# Altium schematic sheet DCDC_Jetson.SchDoc
size 420 x 297 mm; Address1: Address1; Address2: Address2; Address3: Address3; Address4: Address4; DocumentNumber: 6; SheetNumber: 6; SheetTotal: 6; Перв_применение: Э3
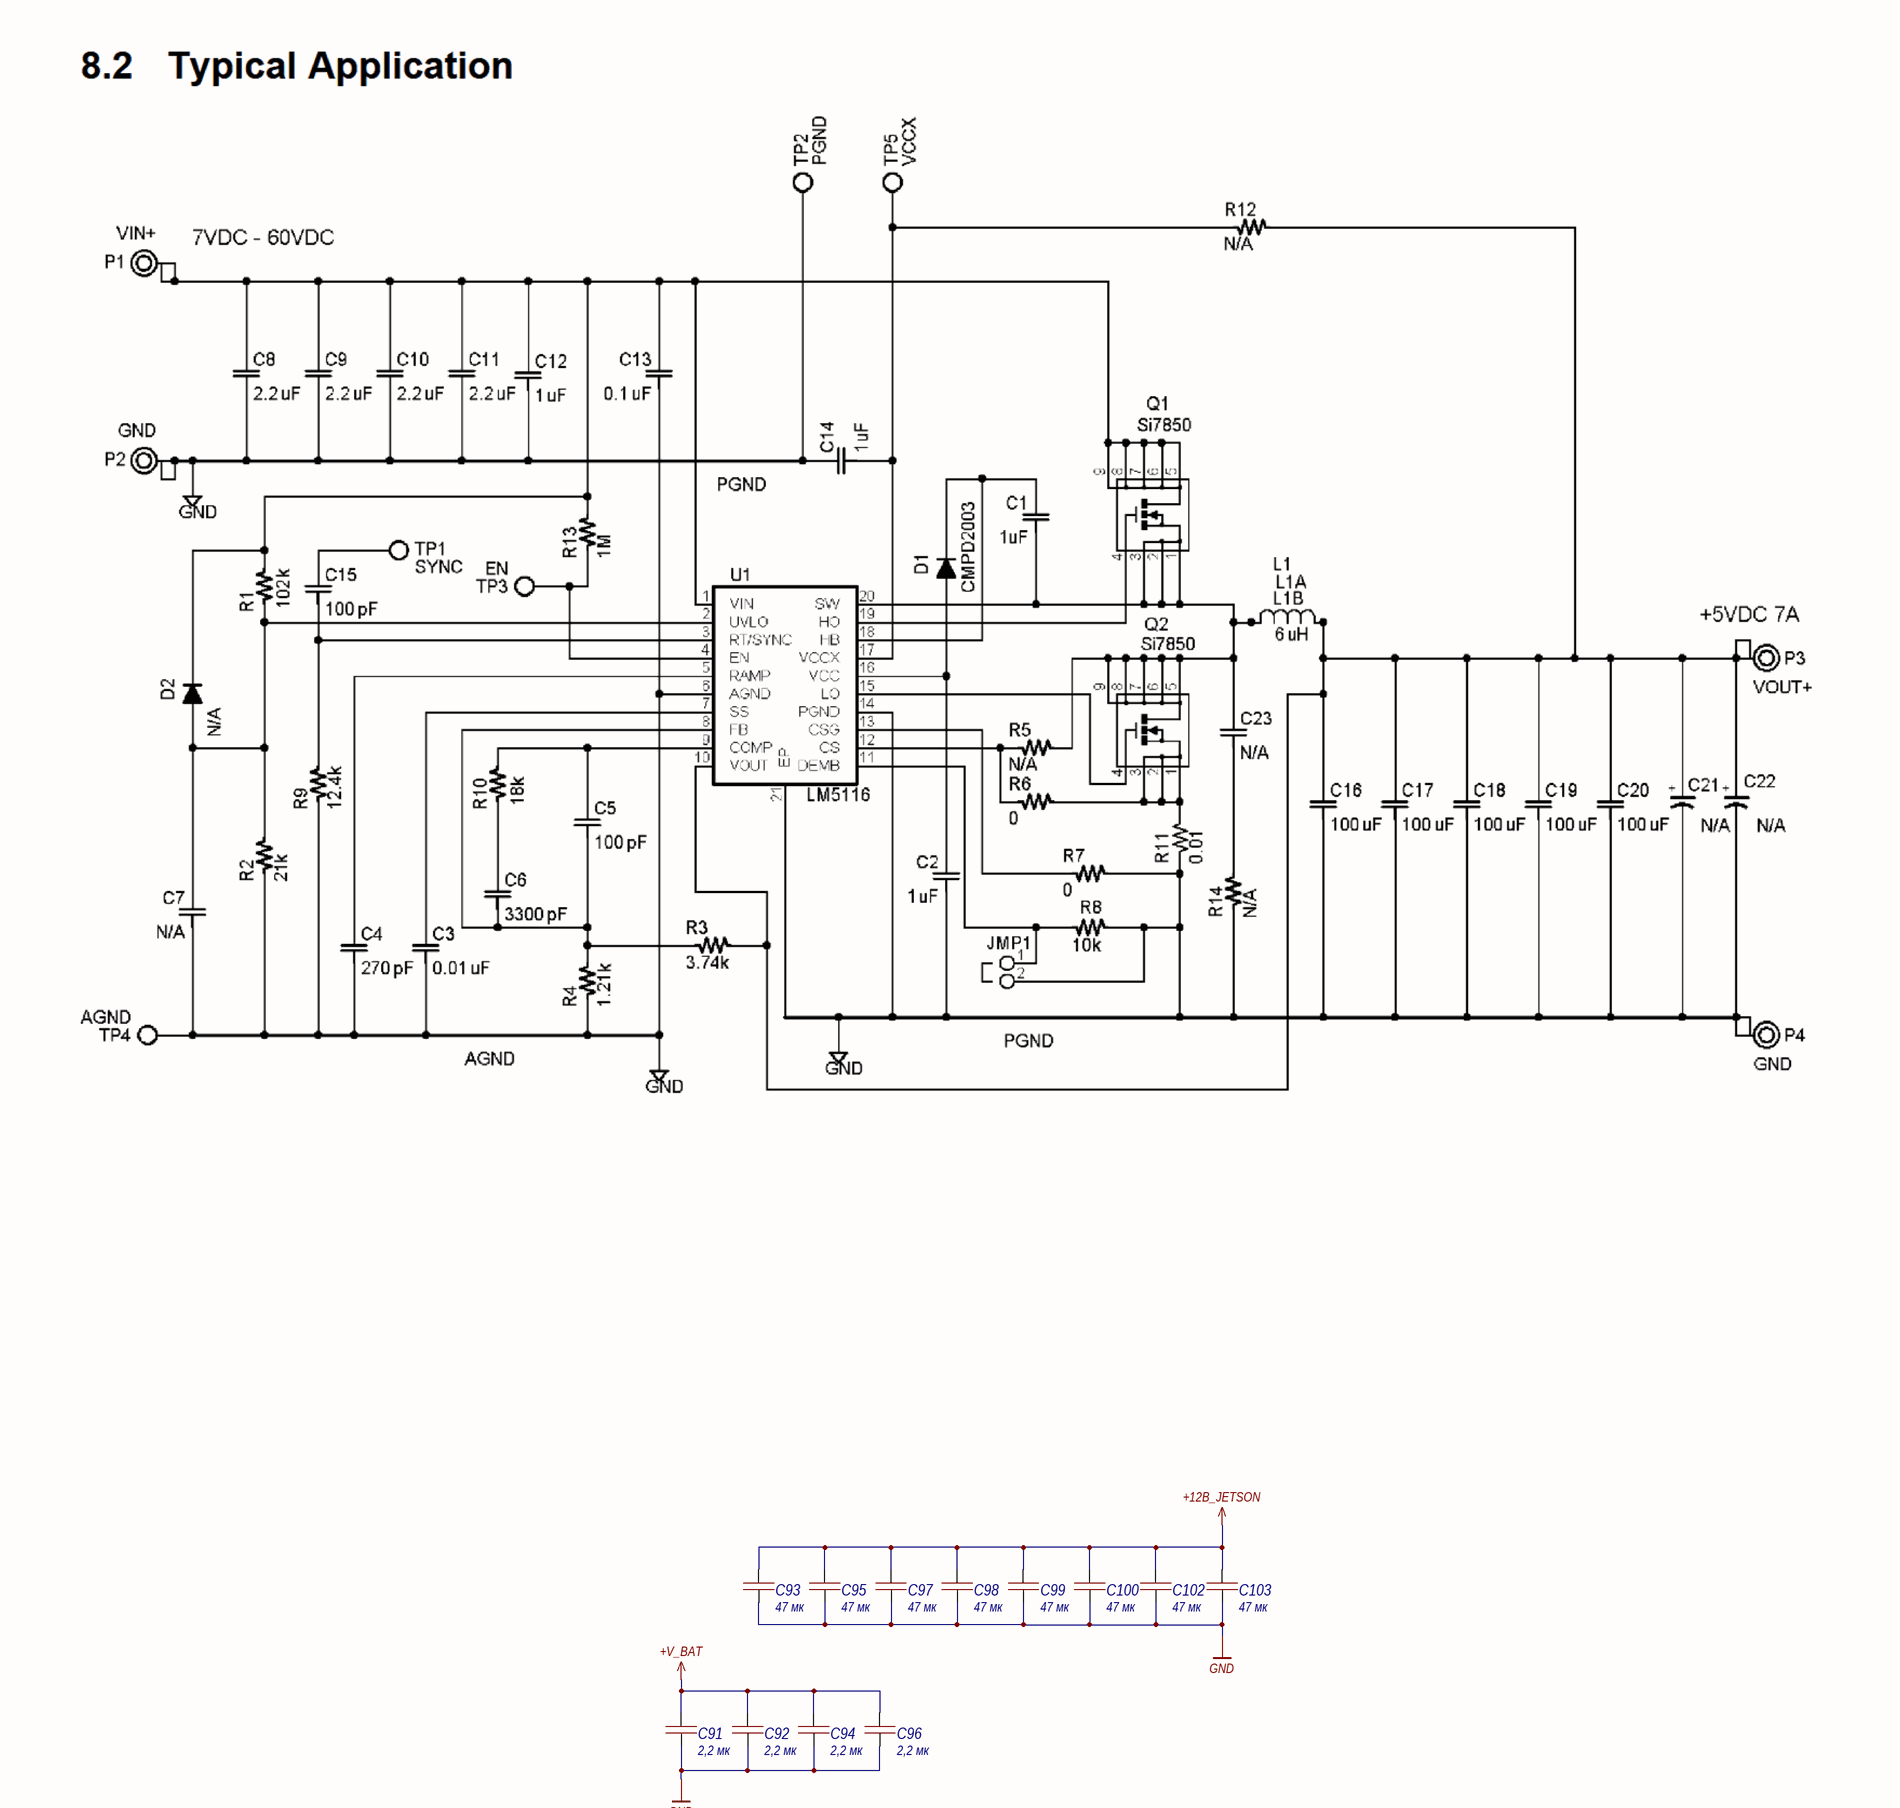
[diagram p0: DCDC_Jetson.SchDoc, top]
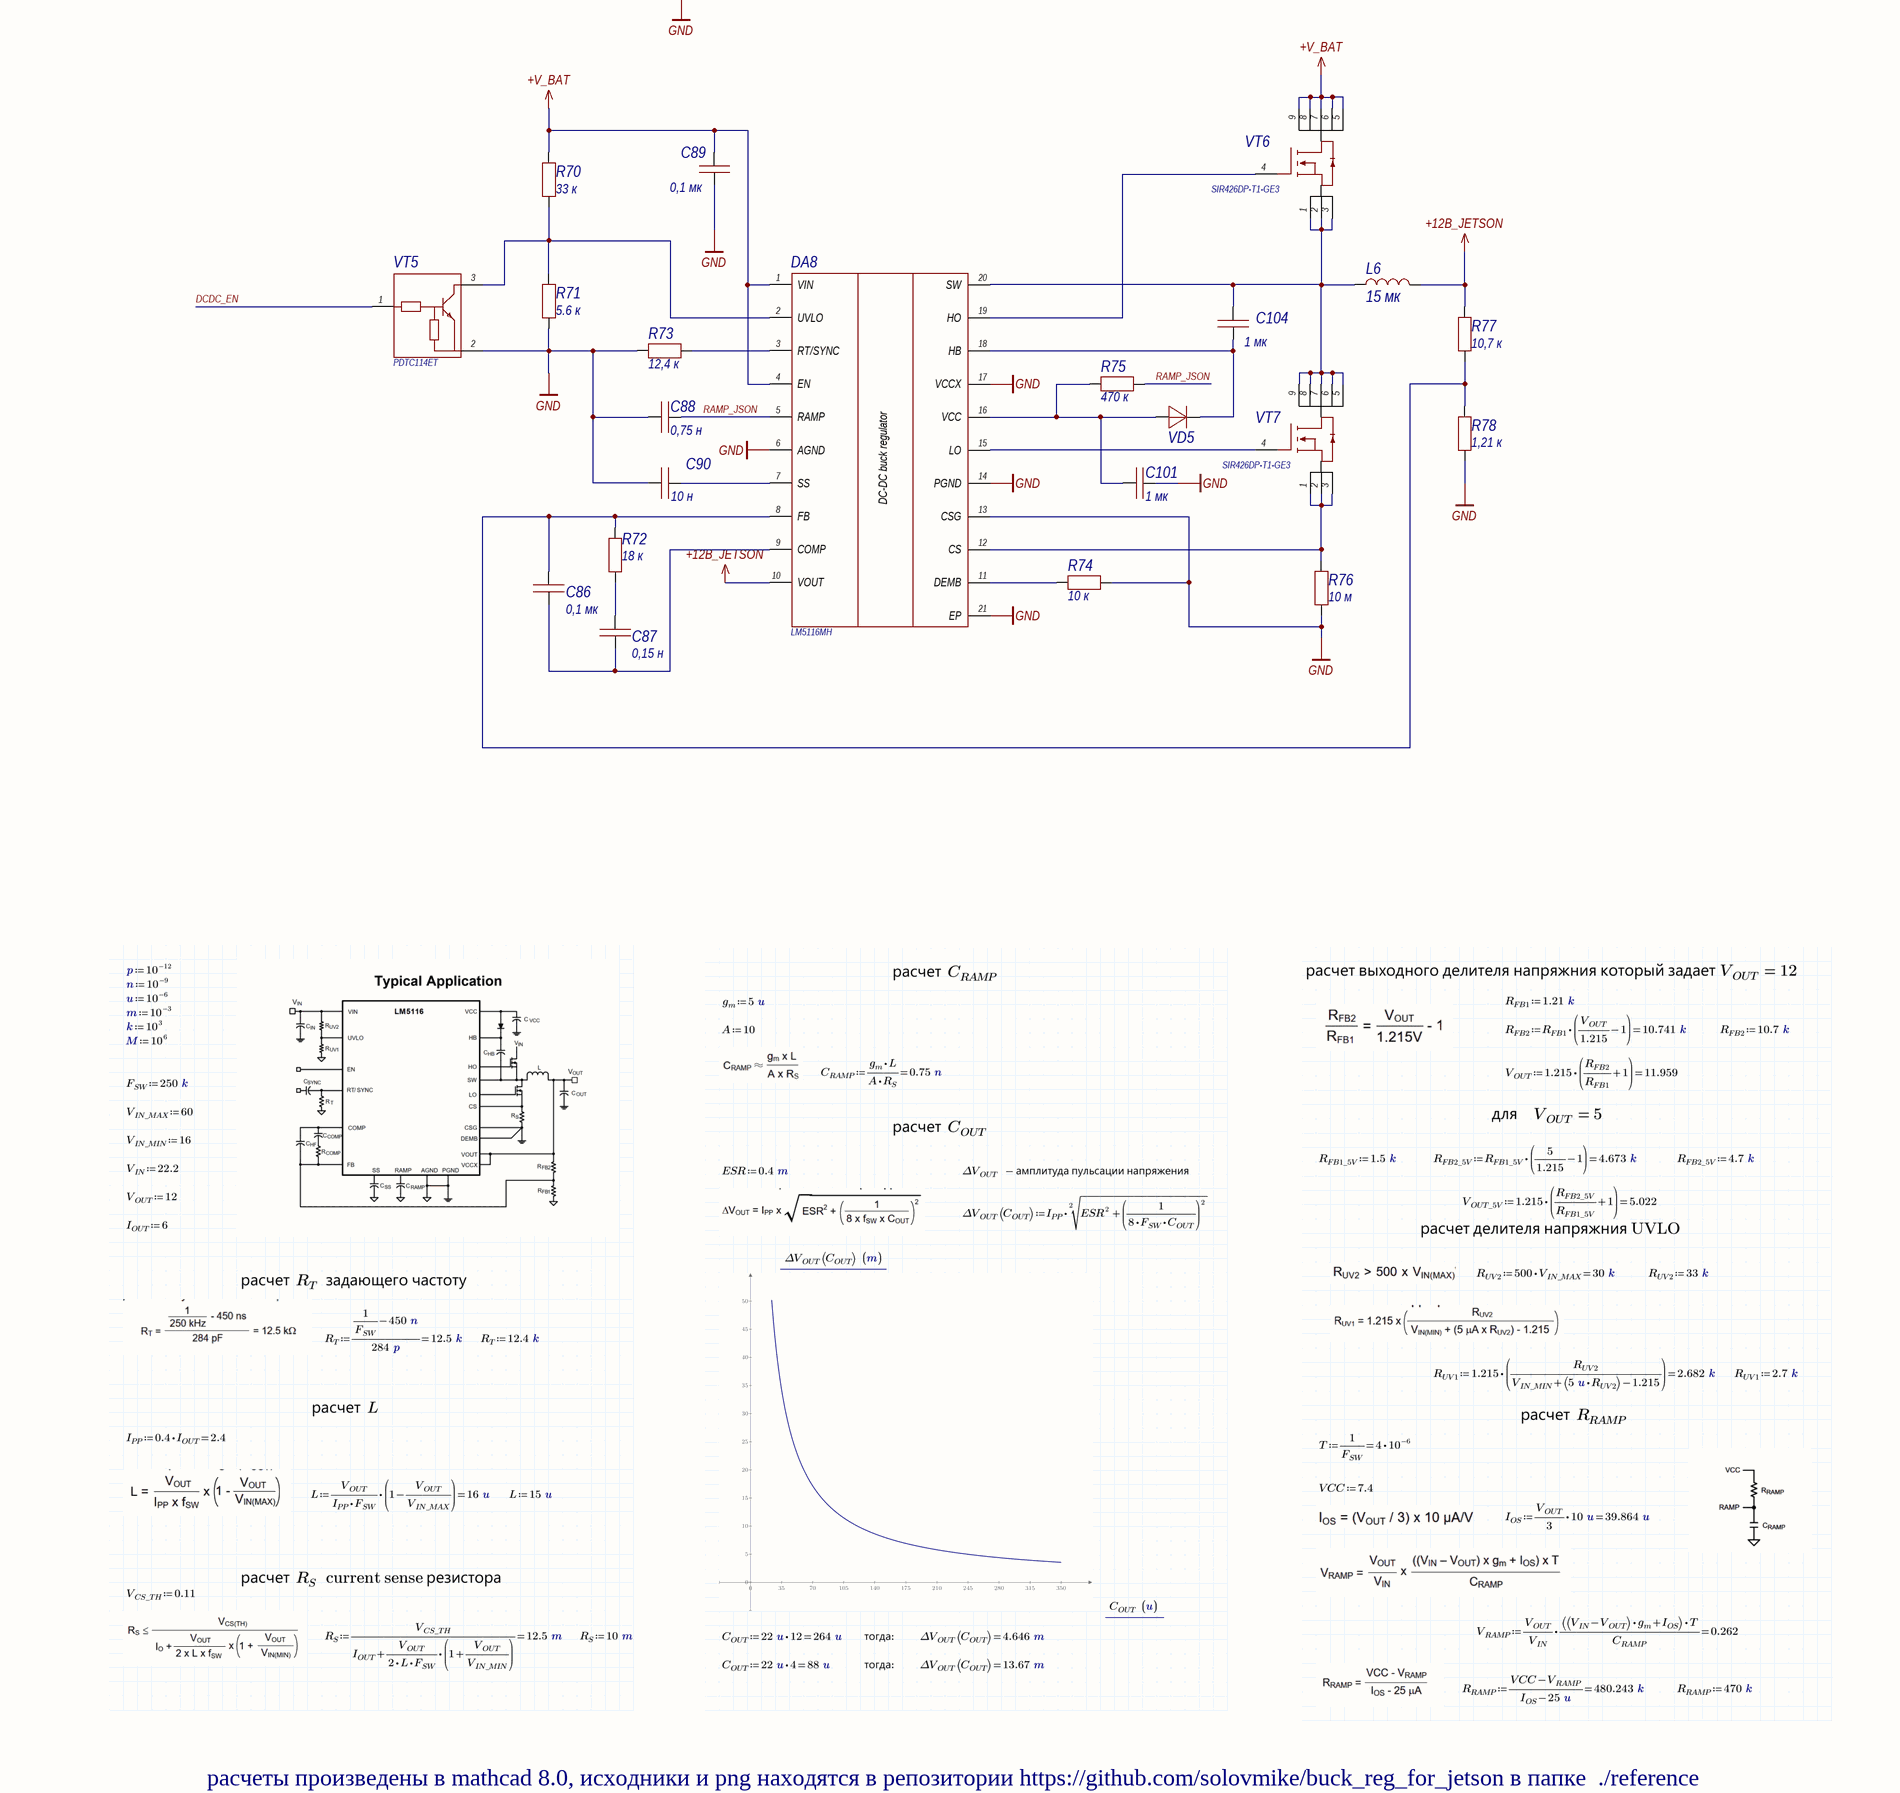
[diagram p1: DCDC_Jetson.SchDoc, bottom]

## Parts
C86  value 0,1 мк  [0603C]  (hidden comment: Capacitor)
C87  value 0,15 н  [0603C]  (hidden comment: Capacitor)
C88  value 0,75 н  [0603C]  (hidden comment: Capacitor)
C89  value 0,1 мк  [0603C]  (hidden comment: Capacitor)
C90  value 10 н  [0603C]  (hidden comment: Capacitor)
C91  value 2,2 мк  [1206C]  (hidden comment: Capacitor)
C92  value 2,2 мк  [1206C]  (hidden comment: Capacitor)
C93  value 47 мк  [1206C]  (hidden comment: GRM31CR61E476ME44L)
C94  value 2,2 мк  [1206C]  (hidden comment: Capacitor)
C95  value 47 мк  [1206C]  (hidden comment: GRM31CR61E476ME44L)
C96  value 2,2 мк  [1206C]  (hidden comment: Capacitor)
C97  value 47 мк  [1206C]  (hidden comment: GRM31CR61E476ME44L)
C98  value 47 мк  [1206C]  (hidden comment: GRM31CR61E476ME44L)
C99  value 47 мк  [1206C]  (hidden comment: GRM31CR61E476ME44L)
C100  value 47 мк  [1206C]  (hidden comment: GRM31CR61E476ME44L)
C101  value 1 мк  [0603C]  (hidden comment: Capacitor)
C102  value 47 мк  [1206C]  (hidden comment: GRM31CR61E476ME44L)
C103  value 47 мк  [1206C]  (hidden comment: GRM31CR61E476ME44L)
C104  value 1 мк  [0603C]  (hidden comment: Capacitor)
DA8  LM5116MH  [HTSSOP-20]
L6  value 15 мк  [IHLP-4040]  (hidden comment: IHLP4040DZER150M11)
R70  value 33 к  [0603R]  (hidden comment: Resistor)
R71  value 5.6 к  [0603R]  (hidden comment: Resistor)
R72  value 18 к  [0603R]  (hidden comment: Resistor)
R73  value 12,4 к  [0603R]  (hidden comment: Resistor)
R74  value 10 к  [0603R]  (hidden comment: Resistor)
R75  value 470 к  [0603R]  (hidden comment: Resistor)
R76  value 10 м  [1210R]  (hidden comment: Resistor)
R77  value 10,7 к  [0603R]  (hidden comment: Resistor)
R78  value 1,21 к  [0603R]  (hidden comment: Resistor)
VD5  S1GFL  [SOD-123F]  (value not drawn)
VT5  PDTC114ET  [SOT23-3]
VT6  SIR426DP-T1-GE3  [PowerPAK_SO-8]
VT7  SIR426DP-T1-GE3  [PowerPAK_SO-8]

## Nets
+12В_JETSON: C93.2 C95.2 C97.2 C98.2 C99.2 C100.2 C102.2 C103.2 DA8.10(VOUT) L6.2 R77.2
+V_BAT: C89.2 C91.2 C92.2 C94.2 C96.2 DA8.1(VIN) DA8.4(EN) R70.2 VT6.5 VT6.6 VT6.7 VT6.8 VT6.9
GND: C88.1 C89.1 C90.1 C91.1 C92.1 C93.1 C94.1 C95.1 C96.1 C97.1 C98.1 C99.1 C100.1 C101.2 C102.1 C103.1 DA8.6(AGND) DA8.13(CSG) DA8.14(PGND) DA8.17(VCCX) DA8.21(EP) R71.1 R73.1 R74.2 R76.1 R78.1 VT5.2(E)
DCDC_EN: VT5.1(B)
RAMP_JSON: C88.2 DA8.5(RAMP) R75.2
NetC86_1: C86.1 C87.1 DA8.9(COMP)
NetC86_2: C86.2 DA8.8(FB) R72.2 R77.1 R78.2
NetC87_2: C87.2 R72.1
NetC90_2: C90.2 DA8.7(SS)
NetC101_1: C101.1 DA8.16(VCC) R75.1 VD5.1
NetC104_1: C104.1 DA8.18(HB) VD5.2
NetC104_2: C104.2 DA8.20(SW) L6.1 VT6.1 VT6.2 VT6.3 VT7.5 VT7.6 VT7.7 VT7.8 VT7.9
NetDA8_2: DA8.2(UVLO) R70.1 R71.2 VT5.3(C)
NetDA8_3: DA8.3(RT/SYNC) R73.2
NetDA8_11: DA8.11(DEMB) R74.1
NetDA8_12: DA8.12(CS) R76.2 VT7.1 VT7.2 VT7.3
NetDA8_15: DA8.15(LO) VT7.4
NetDA8_19: DA8.19(HO) VT6.4

## Notes on the sheet
- расчеты произведены в mathcad 8.0, исходники и png находятся в репозитории https://github.com/solovmike/buck_reg_for_jetson в папке  ./reference
- Перв. примен.
- Справ. №
- Подп. и дата
- Инв. № дубл.
- Взам. инв. №
- Инв. № подл.
- Изм.
- Лист
- № докум.
- Подп.
- Дата
- Копировал
- Формат А3
- (in symbol LM5116MH) DC-DC buck regulator

## Library data of the parts
C86 = Capacitor_0,1u_10_50V_X7R_0603C: Конденсатор 0603C ёмкостью 0,1 мк 10%, 50 В, X7R; Voltage (V): 50; Capacity (nF): 100; Part Number: Capacitor_0,1u_10_50V_X7R_0603C; Tolerance: 10%; Dielectric: X7R
C87 = Capacitor_0,15n_10_50V_X7R_0603C: Конденсатор; Library Path2: Schematic\Capacitor.SchLib; Tolerance: 0,1; Voltage (V): 50; Dielectric: X7R; Capacity (nF): 0,15; Part Number: Capacitor_0,15n_10_50V_X7R_0603C
C88 = Capacitor_0,75n_10_50V_X7R_0603C: Конденсатор; Library Path2: Schematic\Capacitor.SchLib; Tolerance: 0,1; Voltage (V): 50; Dielectric: X7R; Capacity (nF): 0,75; Part Number: Capacitor_0,75n_10_50V_X7R_0603C
C89 = Capacitor_0,1u_10_50V_X7R_0603C: Конденсатор; Library Path2: Schematic\Capacitor.SchLib; Tolerance: 0,1; Voltage (V): 50; Dielectric: X7R; Capacity (nF): 100; Part Number: Capacitor_0,1u_10_50V_X7R_0603C
C90 = Capacitor_10n_10_50V_X7R_0603C: Конденсатор; Library Path2: Schematic\Capacitor.SchLib; Tolerance: 0,1; Voltage (V): 50; Dielectric: X7R; Capacity (nF): 10; Part Number: Capacitor_10n_10_50V_X7R_0603C
C91 C92 C94 C96 = Capacitor_2,2u_10_50V_X7R_1206C: Конденсатор 1206C ёмкостью 2,2 мк 10%, 50 В, X7R; Voltage (V): 50; Capacity (nF): 2200; Part Number: Capacitor_2,2u_10_50V_X7R_1206C; Tolerance: 10%; Dielectric: X7R
C93 C95 C97-C100 C102 C103 = GRM31CR61E476ME44L: Конденсатор 1206C ёмкостью 47 мк 20%, 25 В, X5R; Voltage (V): 25; Capacity (nF): 47000; Автор: rreali; Datasheet: https://cdn.promelec.ru/upload/items/2020/02/18/MURATA_MLCC_catalog_C02E_short_.pdf; Part Number: GRM31CR61E476ME44L; Tolerance: 20%; Dielectric: X5R
C101 C104 = Capacitor_1u_10_50V_X7R_0603C: Конденсатор; Library Path2: Schematic\Capacitor.SchLib; Tolerance: 0,1; Voltage (V): 50; Dielectric: X7R; Capacity (nF): 1000; Part Number: Capacitor_1u_10_50V_X7R_0603C
DA8 = LM5116MH: dc-dc понижающий adj 6-100v; Manufacturer_Part_Number: LM5116MH/NOPB; Part Number: LM5116MH
L6 = IHLP4040DZER150M11: Катушка индуктивности SMD экранированная 15мкГн ±20% 6,25A 45мОм; Inductance (μH): 15; Current: 6,25 А; Автор: rreali; Part Number: IHLP4040DZER150M11; Datasheet: cdn.promelec.ru/upload/datasheet/1/f/lp40dz11.pdf
R70 = Resistor_33k_1_0603: Резистор номиналом 33 кОм и точностью 1%; Power: *; Part Number: Resistor_33k_1_0603; Tolerance: 1%
R71 = Resistor_2.7k_1_0603: Резистор номиналом 2,7 кОм и точностью 1%; Power: *; Part Number: Resistor_2.7k_1_0603; Tolerance: 1%
R72 = Resistor_18k_1_0603: Резистор номиналом 18 кОм 1%; Power: *; Part Number: Resistor_18k_1_0603; Tolerance: 1%
R73 = Resistor_12.4k_1_0603: Резистор номиналом 12,4 кОм и точностью 1%; Power: *; Part Number: Resistor_12.4k_1_0603; Tolerance: 1%
R74 = Resistor_10k_1_0603: Резистор номиналом 10 кОм и точностью 1%; Power: *; Part Number: Resistor_10k_1_0603; Tolerance: 1%
R75 = Resistor_470k_1_0603: Резистор номиналом 470 кОм и точностью 1%; Power: *; Part Number: Resistor_470k_1_0603; Tolerance: 1%
R76 = RL1210FR-070R01L: Резистор номиналом 10 мОм, точностью 1%, 0.5Вт; Power: *; Part Number: RL1210FR-070R01L; Tolerance: 1%
R77 = Resistor_10.7k_1_0603: Резистор номиналом 10,7 кОм 1%; Power: *; Part Number: Resistor_10.7k_1_0603; Tolerance: 1%
R78 = Resistor_1.21k_1_0603: Резистор номиналом 1,21 кОм 1%; Power: *; Part Number: Resistor_1.21k_1_0603; Tolerance: 1%
VD5 = S1GFL: Диод 400В 1A [SOD-123F]; Voltage (V): 400; Current: 1 А; Автор: rreali; Part Number: S1GFL; Datasheet: https://static.chipdip.ru/lib/868/DOC011868843.pdf
VT5 = PDTC114ET: цифровой npn 50в 100мА; Current (A): 0, 1 А; Part Number: PDTC114ET; Voltage (V): 50 В
VT6 VT7 = SIR426DP-T1-GE3: Транзистор полевой MOSFET N-канальный 40В 41.7Вт; Part Number: SIR426DP-T1-GE3; Напряжение С-И/К-Э: 40 В